# EAGLE design smt (EAGLE 6.6.0)
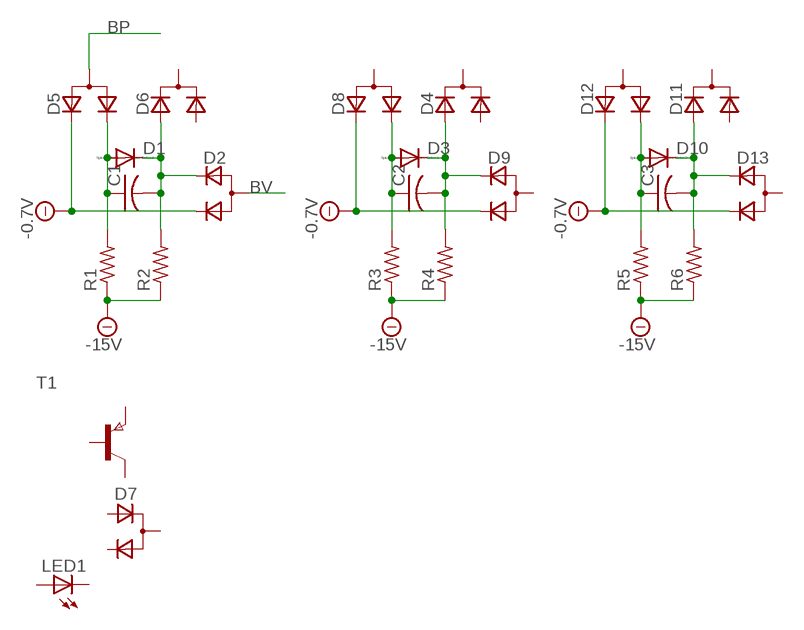
[diagram p0: schematic, sheet 1]

## Parts
C1  C-USC0603  [C0603]
C2  C-USC0603  [C0603]
C3  C-USC0603  [C0603]
D1  DIODE-SOD323-R  [SOD323-R]
D2  D_2CSOT323  [SOT323]
D3  DIODE-SOD323-R  [SOD323-R]
D4  D_2ASOT323  [SOT323]
D5  D_2CSOT323  [SOT323]
D6  D_2ASOT323  [SOT323]
D7  D_ACACSOT323  [SOT323]
D8  D_2CSOT323  [SOT323]
D9  D_2CSOT323  [SOT323]
D10  DIODE-SOD323-R  [SOD323-R]
D11  D_2ASOT323  [SOT323]
D12  D_2CSOT323  [SOT323]
D13  D_2CSOT323  [SOT323]
LED1  LEDCHIPLED_0603  [CHIPLED_0603]
R1  R-US_R0603  [R0603]
R2  R-US_R0603  [R0603]
R3  R-US_R0603  [R0603]
R4  R-US_R0603  [R0603]
R5  R-US_R0603  [R0603]
R6  R-US_R0603  [R0603]
T1  PNPSOT323  [SOT323]

## Nets
-1V: D2.3(C2) D5.2(C1) D8.2(C1) D9.3(C2) D12.2(C1) D13.3(C2) ; supply symbol labelled -0.7V
-15V: R1.1 R2.1 R3.1 R4.1 R5.1 R6.1
BP: D5.1(A)
BV: D2.1(A)
N$1: C1.1 D1.A D5.3(C2) R1.2
N$2: C1.2 D1.C D2.2(C1) D6.2(A1) R2.2
N$3: C2.1 D3.A D8.3(C2) R3.2
N$4: C2.2 D3.C D4.2(A1) D9.2(C1) R4.2
N$5: C3.1 D10.A D12.3(C2) R5.2
N$6: C3.2 D10.C D11.2(A1) D13.2(C1) R6.2
Unconnected: D4.1(C) D4.3(A2) D6.1(C) D6.3(A2) D7.1(CA) D7.2(C) D7.3(A) D8.1(A) D9.1(A) D11.1(C) D11.3(A2) D12.1(A) D13.1(A) LED1.A LED1.C T1.1(C) T1.2(B) T1.3(E)

## Library data of the parts
C1-C3 = rcl:C-US: CAPACITOR, American symbol
D1 D3 D10 = diode:DIODE-: DIODE
D2 D5 D8 D9 D12 D13 = zetex:D_2C: Dual DIODE; OC_FARNELL: unknown; OC_NEWARK: unknown
D4 D6 D11 = zetex:D_2A: Dual DIODE; OC_FARNELL: unknown; OC_NEWARK: unknown
D7 = zetex:D_ACAC: Dual DIODE; OC_FARNELL: unknown; OC_NEWARK: unknown
LED1 = led:LED: LED OSRAM: - CHIPLED LG R971, LG N971, LY N971, LG Q971, LY Q971, LO R971, LY R971 LH N974, LH R974 LS Q976, LO Q976, LY Q976 LO Q996 - Hyper CHIPLED LW Q18S LB Q993, LB Q99A, LB R99A - SideLED LS A670, LO A670, LY A670, LG A670, LP A670 LB A673, LV A673, LT A673, LW A673 LH A674 LY A675 LS A676, LA A676, LO A676, LY A676, LW A676 LS A679, LY A679, LG A679 - Hyper Micro SIDELED® LS Y876, LA Y876, LO Y876, LY Y876 LT Y87S - SmartLED LW L88C, LW L88S LB L89C, LB L89S, LG L890 LS L89K, LO L89K, LY L89K LS L896, LA L896, LO L896, LY L896 - TOPLED LS T670, LO T670, LY T670, LG T670, LP T670 LSG T670, LSP T670, LSY T670, LOP T670, LYG T670 LG T671, LOG T671, LSG T671 LB T673, LV T673, LT T673, LW T673 LH T674 LS T676, LA T676, LO T676, LY T676, LB T676, LH T676, LSB T676, LW T676 LB T67C, LV T67C, LT T67C, LS T67K, LO T67K, LY T67K, LW E67C LS E67B, LA E67B, LO E67B, LY E67B, LB E67C, LV E67C, LT E67C LW T67C LS T679, LY T679, LG T679 LS T770, LO T770, LY T770, LG T770, LP T770 LB T773, LV T773, LT T773, LW T773 LH T774 LS E675, LA E675, LY E675, LS T675 LS T776, LA T776, LO T776, LY T776, LB T776 LHGB T686 LT T68C, LB T68C - Hyper Mini TOPLED® LB M676 - Mini TOPLED Santana® LG M470 LS M47K, LO M47K, LY M47K Source: http://www.osram.convergy.de LUXEON: - LUMILED® LXK2-PW12-R00, LXK2-PW12-S00, LXK2-PW14-U00, LXK2-PW14-V00 LXK2-PM12-R00, LXK2-PM12-S00, LXK2-PM14-U00 LXK2-PE12-Q00, LXK2-PE12-R00, LXK2-PE12-S00, LXK2-PE14-T00, LXK2-PE14-U00 LXK2-PB12-K00, LXK2-PB12-L00, LXK2-PB12-M00, LXK2-PB14-N00, LXK2-PB14-P00, LXK2-PB14-Q00 LXK2-PR12-L00, LXK2-PR12-M00, LXK2-PR14-Q00, LXK2-PR14-R00 LXK2-PD12-Q00, LXK2-PD12-R00, LXK2-PD12-S00 LXK2-PH12-R00, LXK2-PH12-S00 LXK2-PL12-P00, LXK2-PL12-Q00, LXK2-PL12-R00 Source: www.luxeon.com KINGBRIGHT: KA-3528ASYC Source: www.kingbright.com
R1-R6 = rcl:R-US_: RESISTOR, American symbol
T1 = zetex:PNPSOT323: PNP TRANSISTOR; MPN: 2DB1689-7; OC_FARNELL: 1710698; OC_NEWARK: 25R5667

## Board
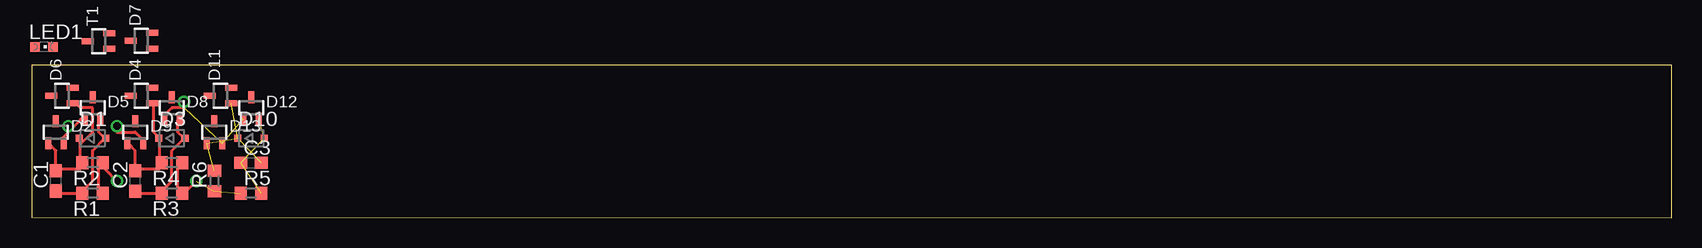
[diagram p1: board, top side]
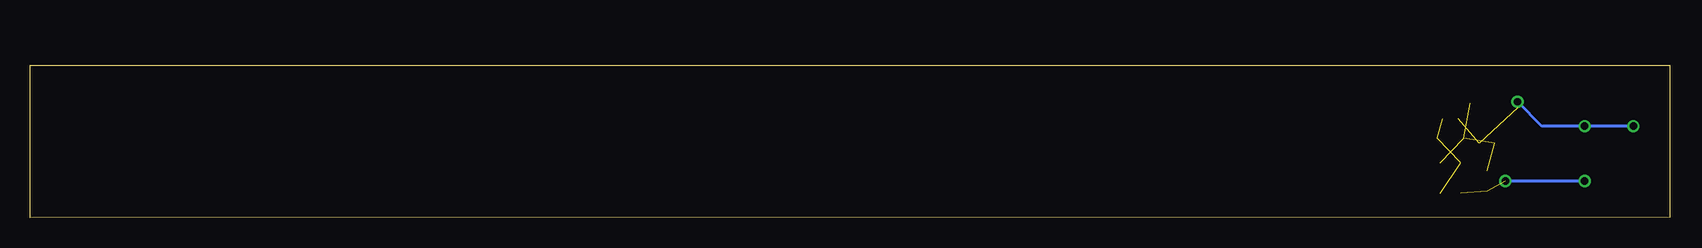
[diagram p2: board, bottom side, seen from below]

Size 136.65 x 12.71 mm. Coordinates in mm from the lower left corner, seen from the top.
Outline: 136.65,0 136.65,12.68 0,12.71 0,0.02 136.65,0
Copper layers (1*16): Top 0.035mm / dielectric 1.5mm / Bottom 0.035mm
Design rules "olimex8mil": minimum track width 10mil, minimum drill 24mil, track to track 8mil, track to pad 8mil, pad to pad 8mil, via to via 8mil, smd to smd 8mil, copper to edge 40mil, drill to drill 10mil, minimum pad ring 10mil, minimum via ring 8mil, stop-mask expansion 0mil, vias tented up to drill 0mil, thermal gap 10mil

### Footprints (pad centres in the part's own frame; a part is rotated, then mirrored left to right if it is on the bottom)
C0603 = smd 1.1 x 1: 1 -0.85,0; 2 0.85,0
SOD323-R = smd 0.6 x 0.6: A 1.1,0; C -1.1,0
SOT323 = smd 0.5 x 1: 1 0,0.9; 2 -0.65,-0.9; 3 0.65,-0.9
CHIPLED_0603 = smd 0.8 x 0.8: A 0,-0.75; C 0,0.75
R0603 = smd 1 x 1.1: 1 -0.85,0; 2 0.85,0

### Placement (x,y rotation side)
C1  2.02,3.06 90 top
C2  8.62,3.04 90 top
C3  18.28,4.57 0 top
D1  5.07,6.6 0 top
D2  2.02,7.11 0 top
D3  11.67,6.6 0 top
D4  9.13,10.15 90 top
D5  5.07,9.14 0 top
D6  2.53,10.15 90 top
D7  9.13,14.73 90 top
D8  11.67,9.14 0 top
D9  8.62,7.11 0 top
D10  18.28,6.6 0 top
D11  15.74,10.15 90 top
D12  18.28,9.14 0 top
D13  15.23,7.11 0 top
LED1  1,14.22 270 top
R1  5.07,2.03 180 top
R2  5.07,4.57 180 top
R3  11.67,2.03 180 top
R4  11.67,4.57 180 top
R5  18.28,2.03 0 top
R6  15.23,3.04 90 top
T1  5.58,14.7 90 top

### Tracks (layer width: path | path; a pad name or v marks a point on that pad's centre or on a via)
-1V  (via drill 0.61)  (2 unrouted)
  Top 0.254: 3.54,7.62 4.56,8.63 D5.2 | 3.54,7.62 2.53,6.6 D2.3 | v7.1,7.62 7.1,7.11 8.62,7.11 9.13,6.6 D9.3 | 3.54,7.62 v3.04,7.62 | v12.69,9.65 12.69,9.14 11.67,9.14 11.16,8.63 D8.2
  Bottom 0.254: v3.04,7.62 v7.1,7.62 10.66,7.62 v12.69,9.65
-15V  (via drill 0.61)  (2 unrouted)
  Top 0.254: R1.1 5.58,2.54 5.58,4.06 R2.1 6.08,4.06 v7.1,3.04 | R4.1 12.18,4.06 12.18,2.54 R3.1 12.69,2.03 v13.7,3.04
  Bottom 0.254: v7.1,3.04 v13.7,3.04
N$1
  Top 0.254: 6.08,6.6 5.58,7.11 5.58,8.12 D5.3 | 6.08,6.6 D1.A 6.08,6.6 | C1.1 2.02,2.03 4.05,2.03 R1.2 4.56,2.54 5.07,3.04 5.07,5.58 6.08,6.6
N$2
  Top 0.254: 2.02,4.06 2.02,5.58 1.51,6.09 D2.2 | 2.02,4.06 C1.2 2.02,4.06 | 4.05,6.09 4.05,5.08 R2.2 4.05,4.06 2.02,4.06 | 4.05,6.09 4.05,6.6 D1.C | 4.05,6.09 5.07,7.11 5.07,9.14 4.05,9.14 3.54,9.65 D6.2
N$3
  Top 0.254: 12.69,6.6 12.18,7.11 12.18,8.12 D8.3 | 12.69,6.6 D3.A 12.69,6.6 | C2.1 8.62,2.03 10.66,2.03 R3.2 11.16,2.54 11.67,3.04 11.67,5.58 12.69,6.6
N$4
  Top 0.254: 8.62,4.06 8.62,5.58 8.12,6.09 D9.2 | 8.62,4.06 C2.2 8.62,4.06 | 10.66,6.6 10.66,5.08 R4.2 10.66,4.06 8.62,4.06 | 10.66,6.6 D3.C 10.66,6.6 | 10.66,6.6 10.15,7.11 10.15,9.65 D4.2
N$5  (3 unrouted)
N$6  (4 unrouted)